# EAGLE design nixie12b_clock (EAGLE 6.5.0)
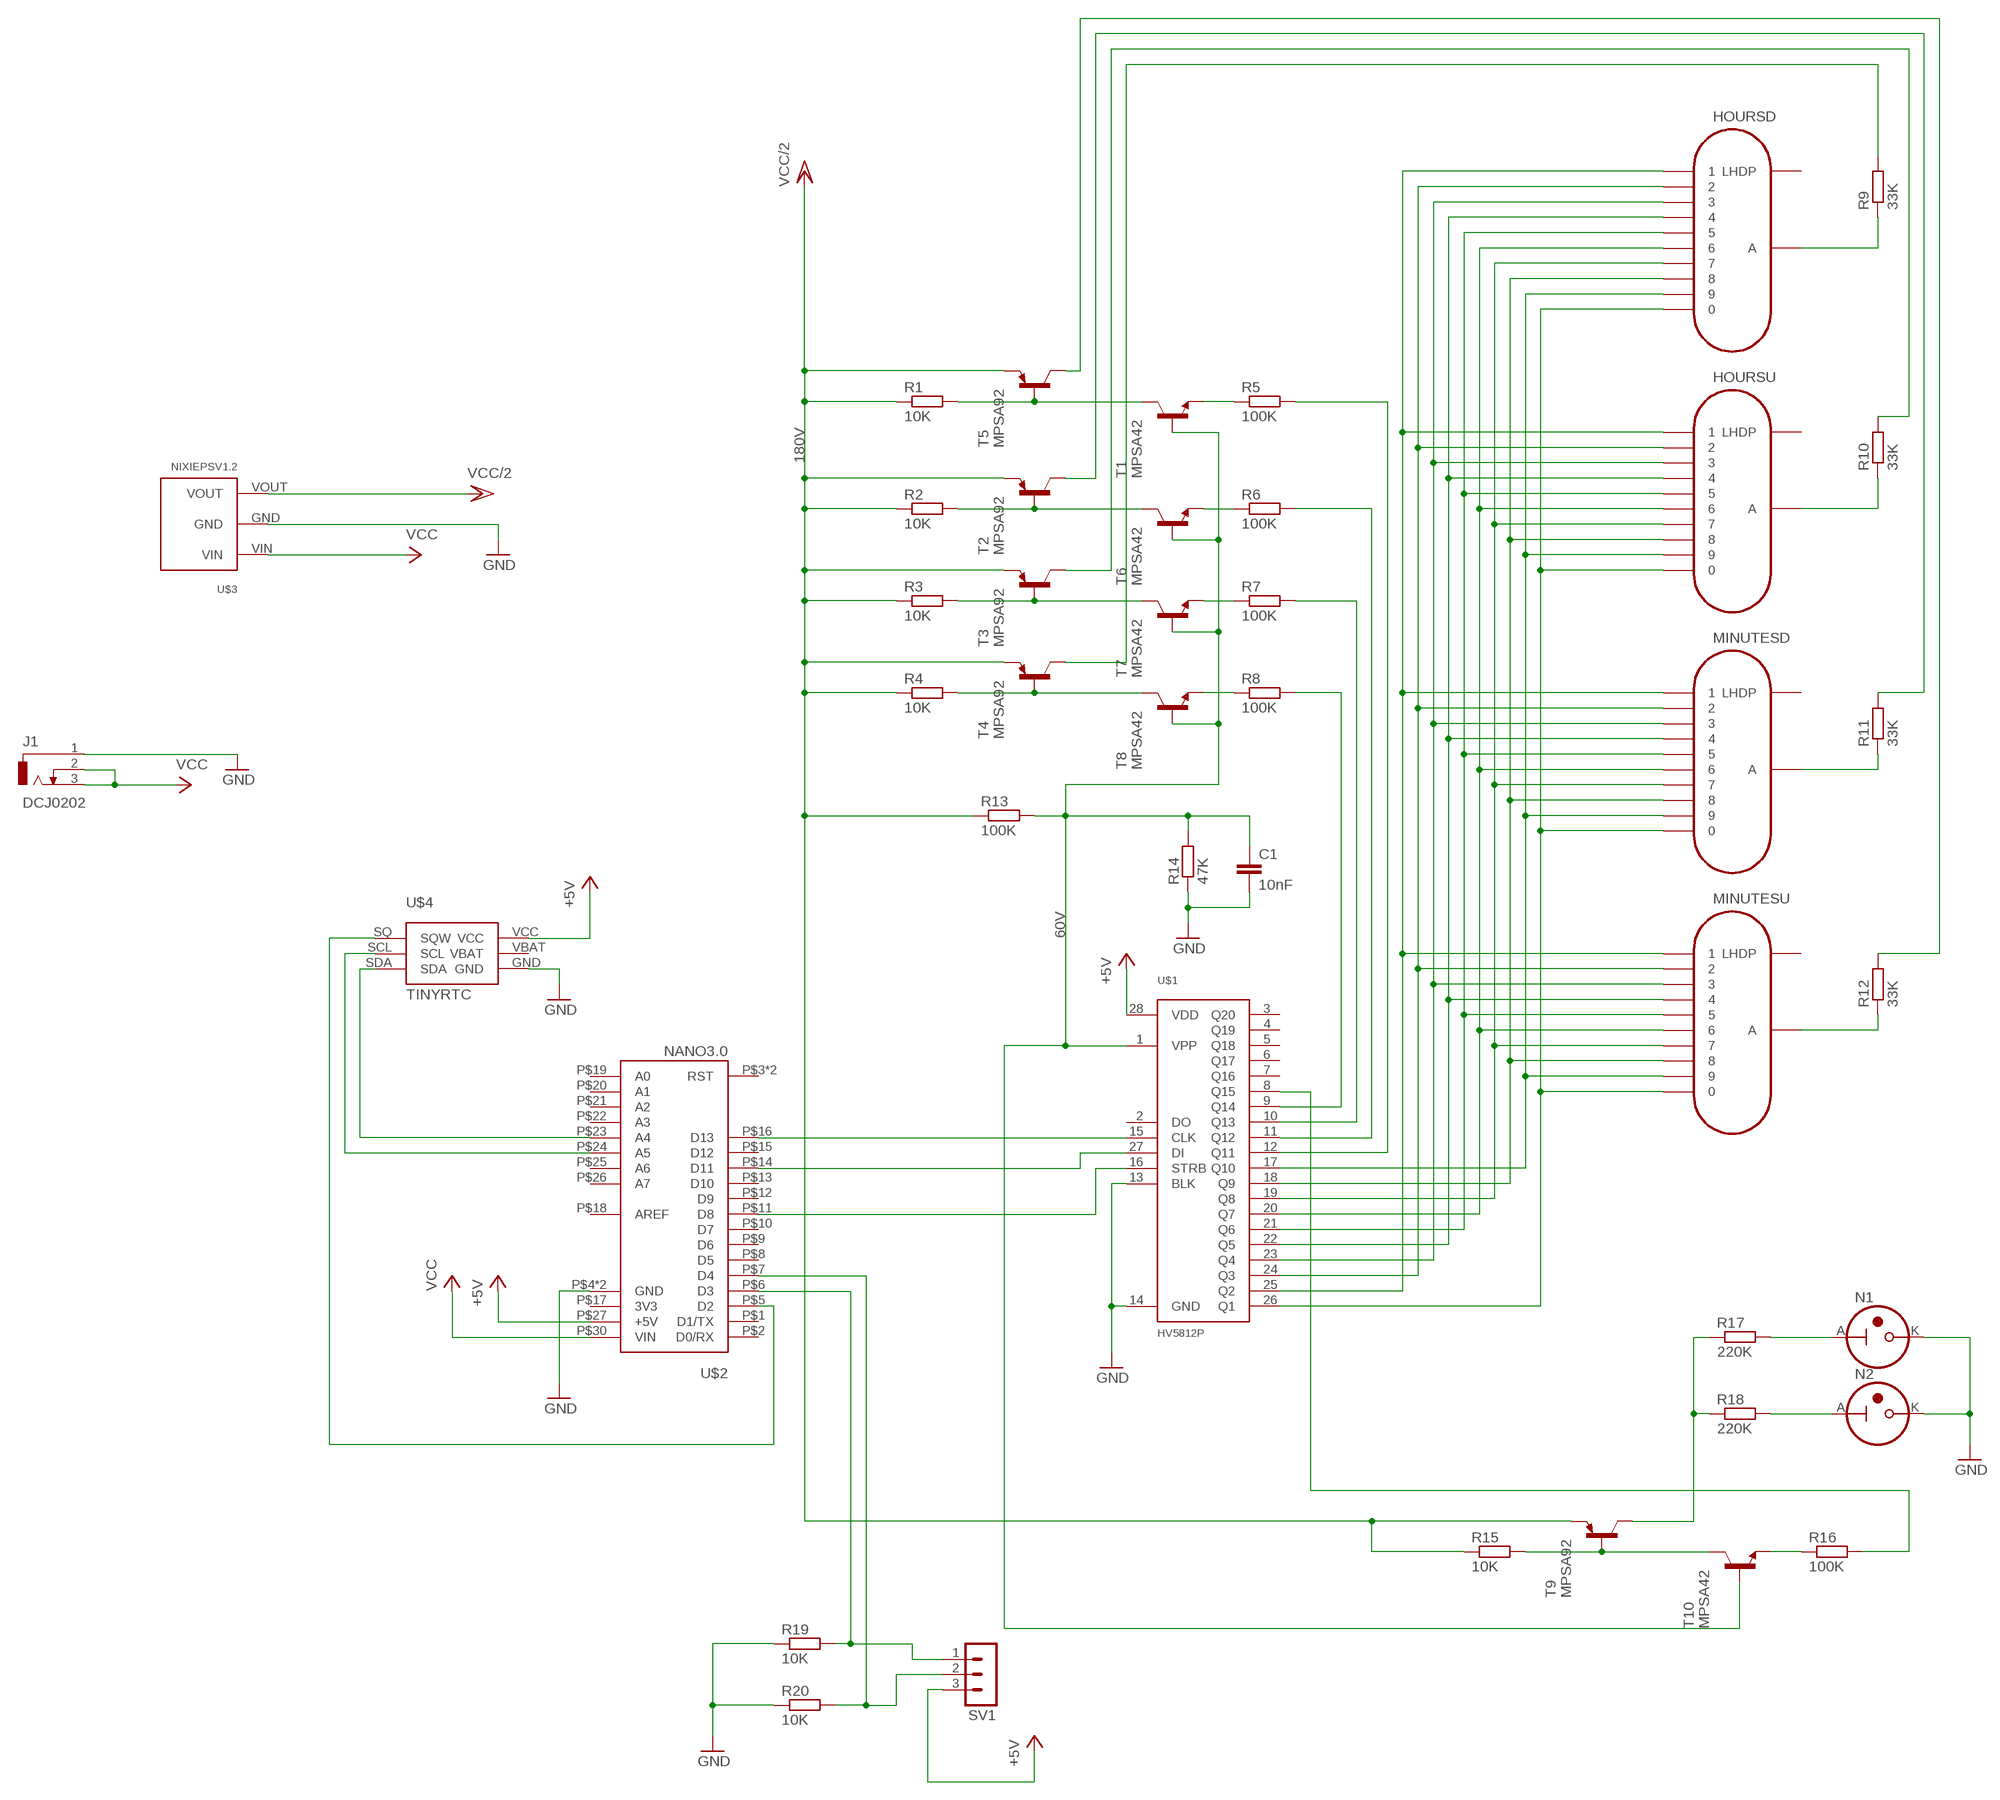
[diagram p0: schematic, sheet 1]

## Parts
C1  10nF  C5/2.5  [C5B2.5]
HOURSD  IN-12BP  [IN-12-2]
HOURSU  IN-12BP  [IN-12-2]
J1  DCJ0202  [DCJ0202]
MINUTESD  IN-12BP  [IN-12-2]
MINUTESU  IN-12BP  [IN-12-2]
N1  IN-3  [IN-3]
N2  IN-3  [IN-3]
R1  10K  R-EU_0207/10  [0207/10]
R2  10K  R-EU_0207/10  [0207/10]
R3  10K  R-EU_0207/10  [0207/10]
R4  10K  R-EU_0207/10  [0207/10]
R5  100K  R-EU_0207/10  [0207/10]
R6  100K  R-EU_0207/10  [0207/10]
R7  100K  R-EU_0207/10  [0207/10]
R8  100K  R-EU_0207/10  [0207/10]
R9  33K  R-EU_0207/10  [0207/10]
R10  33K  R-EU_0207/10  [0207/10]
R11  33K  R-EU_0207/10  [0207/10]
R12  33K  R-EU_0207/10  [0207/10]
R13  100K  R-EU_0207/10  [0207/10]
R14  47K  R-EU_0207/10  [0207/10]
R15  10K  R-EU_0207/10  [0207/10]
R16  100K  R-EU_0207/10  [0207/10]
R17  220K  R-EU_0207/10  [0207/10]
R18  220K  R-EU_0207/10  [0207/10]
R19  10K  R-EU_0207/10  [0207/10]
R20  10K  R-EU_0207/10  [0207/10]
SV1  MA03-1  [MA03-1]
T1  MPSA42  MPSA42-NPN-TO92-EBC  [TO92-EBC]
T2  MPSA92  MPSA92-PNP-TO92-EBC  [TO92-EBC]
T3  MPSA92  MPSA92-PNP-TO92-EBC  [TO92-EBC]
T4  MPSA92  MPSA92-PNP-TO92-EBC  [TO92-EBC]
T5  MPSA92  MPSA92-PNP-TO92-EBC  [TO92-EBC]
T6  MPSA42  MPSA42-NPN-TO92-EBC  [TO92-EBC]
T7  MPSA42  MPSA42-NPN-TO92-EBC  [TO92-EBC]
T8  MPSA42  MPSA42-NPN-TO92-EBC  [TO92-EBC]
T9  MPSA92  MPSA92-PNP-TO92-EBC  [TO92-EBC]
T10  MPSA42  MPSA42-NPN-TO92-EBC  [TO92-EBC]
U$1  HV5812P  [28-PDIP]
U$2  NANO3.0  [NANO3.0_HEADERS]
U$3  NIXIEPSV1.2  [NIXIEPSV1.2]
U$4  TINYRTC  [TINYRTC]

## Nets
+5V: SV1.3 U$1.28(VDD) U$2.P$27(+5V) U$4.VCC
GND: C1.2 J1.1 N1.K N2.K R14.1 R19.1 R20.1 U$1.13(BLK) U$1.14(GND) U$2.P$4(GND) U$2.P$29(GND) U$3.GND U$4.GND
N$1: HOURSD.1 HOURSU.1 MINUTESD.1 MINUTESU.1 U$1.25(Q2)
N$2: HOURSD.2 HOURSU.2 MINUTESD.2 MINUTESU.2 U$1.24(Q3)
N$3: HOURSD.3 HOURSU.3 MINUTESD.3 MINUTESU.3 U$1.23(Q4)
N$4: HOURSD.4 HOURSU.4 MINUTESD.4 MINUTESU.4 U$1.22(Q5)
N$5: HOURSD.5 HOURSU.5 MINUTESD.5 MINUTESU.5 U$1.21(Q6)
N$6: HOURSD.6 HOURSU.6 MINUTESD.6 MINUTESU.6 U$1.20(Q7)
N$7: HOURSD.7 HOURSU.7 MINUTESD.7 MINUTESU.7 U$1.19(Q8)
N$8: HOURSD.8 HOURSU.8 MINUTESD.8 MINUTESU.8 U$1.18(Q9)
N$9: HOURSD.9 HOURSU.9 MINUTESD.9 MINUTESU.9 U$1.17(Q10)
N$10: HOURSD.0 HOURSU.0 MINUTESD.0 MINUTESU.0 U$1.26(Q1)
N$11: R1.2 T1.C T5.B
N$12: R2.2 T2.B T6.C
N$13: R3.2 T3.B T7.C
N$14: R4.2 T4.B T8.C
N$15: R5.1 T1.E
N$16: R6.1 T6.E
N$17: R7.1 T7.E
N$18: R8.1 T8.E
N$19: C1.1 R13.2 R14.2 T1.B T6.B T7.B T8.B T10.B U$1.1(VPP)
N$20: R5.2 U$1.12(Q11)
N$21: R6.2 U$1.11(Q12)
N$22: R7.2 U$1.10(Q13)
N$23: R8.2 U$1.9(Q14)
N$24: R9.2 T4.C
N$25: HOURSD.A R9.1
N$26: R10.2 T3.C
N$27: HOURSU.A R10.1
N$28: R11.2 T2.C
N$29: MINUTESD.A R11.1
N$30: R12.2 T5.C
N$31: MINUTESU.A R12.1
N$32: R15.2 T9.B T10.C
N$33: U$1.16(STRB) U$2.P$11(D8)
N$34: U$1.27(DI) U$2.P$14(D11)
N$35: U$1.15(CLK) U$2.P$16(D13)
N$36: R19.2 SV1.1 U$2.P$6(D3)
N$37: R16.2 U$1.8(Q15)
N$38: R17.1 R18.1 T9.C
N$39: R16.1 T10.E
N$40: N1.A R17.2
N$41: N2.A R18.2
N$42: U$2.P$24(A5) U$4.SCL
N$43: U$2.P$23(A4) U$4.SDA
N$44: U$2.P$5(D2) U$4.SQ(SQW)
N$45: R20.2 SV1.2 U$2.P$7(D4)
VCC: J1.2 J1.3 U$2.P$30(VIN) U$3.VIN
VCC/2: R1.1 R2.1 R3.1 R4.1 R13.1 R15.1 T2.E T3.E T4.E T5.E T9.E U$3.VOUT
Unconnected: HOURSD.LHDP HOURSU.LHDP MINUTESD.LHDP MINUTESU.LHDP U$1.2(DO) U$1.3(Q20) U$1.4(Q19) U$1.5(Q18) U$1.6(Q17) U$1.7(Q16) U$2.P$1(D1/TX) U$2.P$2(D0/RX) U$2.P$3(RST) U$2.P$8(D5) U$2.P$9(D6) U$2.P$10(D7) U$2.P$12(D9) U$2.P$13(D10) U$2.P$15(D12) U$2.P$18(AREF) U$2.P$19(A0) U$2.P$20(A1) U$2.P$21(A2) U$2.P$22(A3) U$2.P$25(A6) U$2.P$26(A7) U$2.P$28(RST)

## Notes on the sheet
- 180V
- 60V

## Power pins joined to a net without a drawn wire
3V3: U$2.P$17(3V3)
VBAT: U$4.VBAT

## Library data of the parts
C1 = capacitor-wima:C: CAPACITOR naming: grid - package width
HOURSD HOURSU MINUTESD MINUTESU = russian-nixies:IN-12B: IN-12B: medium numeric topview nixie tube
J1 = con-jack:DCJ0202: DC POWER JACK Source: DCJ0202.pdf; OC_FARNELL: unknown; OC_NEWARK: unknown
N1 N2 = russian-nixies:IN-3: IN-3: nixie bulb
R1-R20 = resistor:R-EU_: RESISTOR, European symbol
SV1 = con-lstb:MA03-1: PIN HEADER; OC_FARNELL: unknown; OC_NEWARK: unknown
T1 T6-T8 T10 = transistor:*-NPN-: NPN Transistror BF959 corrected 2008.03.06
T2-T5 T9 = transistor:*-PNP-: PNP Transistror
U$1 = supertex2:HV5812: Supertex HV5812
U$2 = arduino:NANO3.0
U$3 = breakboard:NIXIEPSV1.2
U$4 = breakboard:TINYRTC

## Board
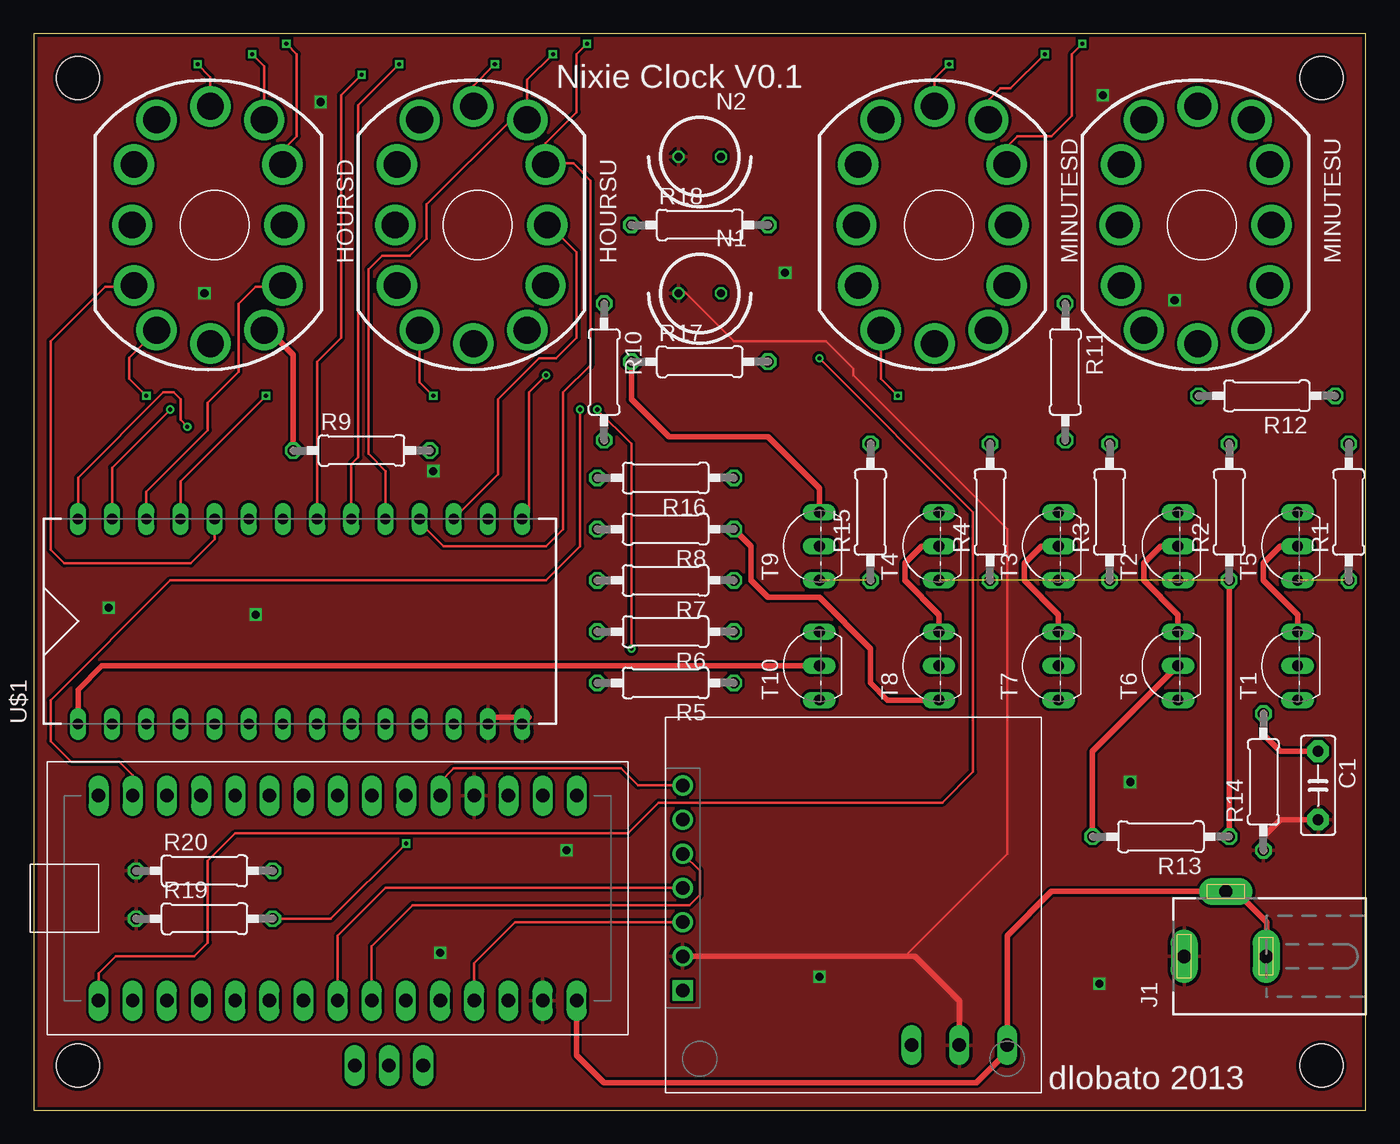
[diagram p1: board, top side]
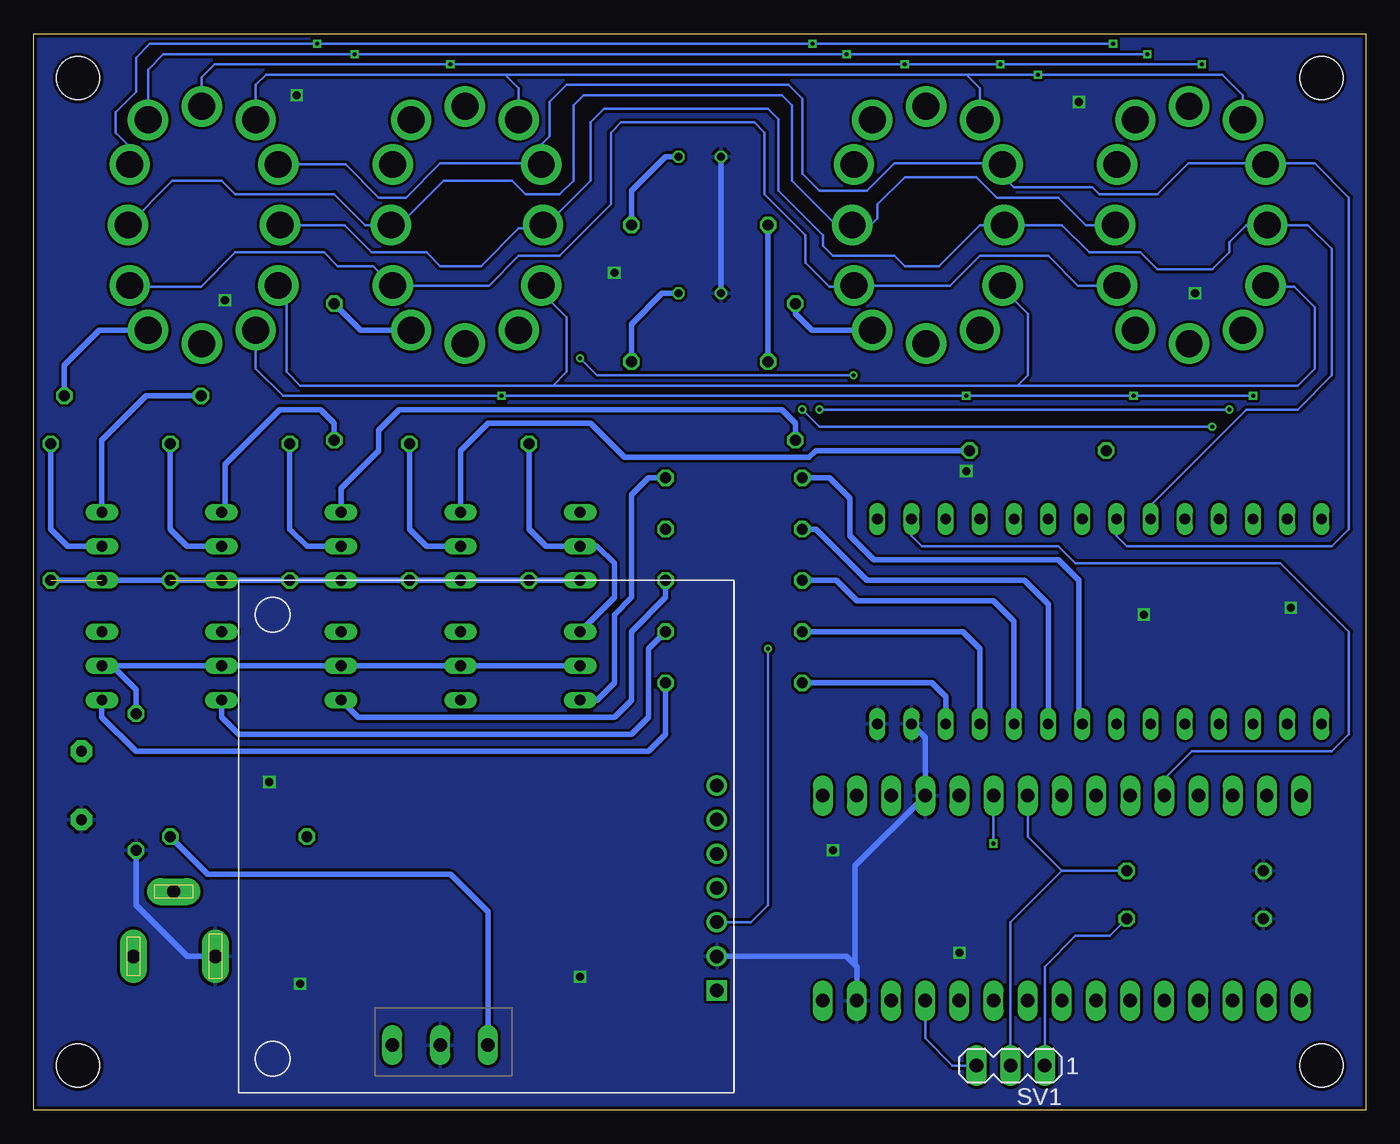
[diagram p2: board, bottom side, seen from below]

Size 99.06 x 80.01 mm. Coordinates in mm from the lower left corner, seen from the top.
Outline: 0,0 99.06,0 99.06,80.01 0,80.01 0,0
Copper layers (1*16): Top 0.035mm / dielectric 0.73mm / Bottom 0.035mm
Design rules "SeeedStudio_DRU_no_angle_20130527 *": minimum track width 8mil, minimum drill 12mil, track to track 8mil, track to pad 8mil, pad to pad 6mil, via to via 6mil, smd to smd 0mil, copper to edge 10mil, drill to drill 10mil, minimum pad ring 6mil, minimum via ring 6mil, stop-mask expansion 2mil, vias tented up to drill 25mil, thermal gap 10mil
Holes 3.2 mm at 3.3,76.71 95.76,76.71 95.76,3.3 3.3,3.3

### Footprints (pad centres in the part's own frame; a part is rotated, then mirrored left to right if it is on the bottom)
C5B2.5 = drill 0.813 pad 1.6 octagon: 1 -2.54,0; 2 2.54,0
IN-12-2 = drill 2 pad 2.54: 0 5.048,-4.5; 1 -4.317,-7.817; 2 -6,-4.5; 3 -6.127,0; 4 -6,4.5; 5 -4.317,7.817; 6 -0.318,8.818; 7 3.683,7.817; 8 5.048,4.5; 9 5.175,0; A 3.683,-7.817; LHDP -0.318,-8.818
DCJ0202 = drill 1 pad 2 long: 1 0,3.1; 2 4.8,0; 3 0,-3
IN-3 = drill 0.6 octagon: A -1.587,0; K 1.587,0
0207/10 = drill 0.813 octagon: 1 -5.08,0; 2 5.08,0
MA03-1 = drill 1.016 long: 1 -2.54,0; 2 0,0; 3 2.54,0
TO92-EBC = drill 0.813 long: B 0,-1.27; C 2.54,-1.27; E -2.54,-1.27
28-PDIP = drill 0.8 long: 1 -7.62,16.51; 2 -7.62,13.97; 3 -7.62,11.43; 4 -7.62,8.89; 5 -7.62,6.35; 6 -7.62,3.81; 7 -7.62,1.27; 8 -7.62,-1.27; 9 -7.62,-3.81; 10 -7.62,-6.35; 11 -7.62,-8.89; 12 -7.62,-11.43; 13 -7.62,-13.97; 14 -7.62,-16.51; 15 7.62,-16.51; 16 7.62,-13.97; 17 7.62,-11.43; 18 7.62,-8.89; 19 7.62,-6.35; 20 7.62,-3.81; 21 7.62,-1.27; 22 7.62,1.27; 23 7.62,3.81; 24 7.62,6.35; 25 7.62,8.89; 26 7.62,11.43; 27 7.62,13.97; 28 7.62,16.51
NANO3.0_HEADERS = drill 1 long: P$1 -7.62,17.78; P$2 -7.62,15.24; P$3 -7.62,12.7; P$4 -7.62,10.16; P$5 -7.62,7.62; P$6 -7.62,5.08; P$7 -7.62,2.54; P$8 -7.62,0; P$9 -7.62,-2.54; P$10 -7.62,-5.08; P$11 -7.62,-7.62; P$12 -7.62,-10.16; P$13 -7.62,-12.7; P$14 -7.62,-15.24; P$15 -7.62,-17.78; P$16 7.62,-17.78; P$17 7.62,-15.24; P$18 7.62,-12.7; P$19 7.62,-10.16; P$20 7.62,-7.62; P$21 7.62,-5.08; P$22 7.62,-2.54; P$23 7.62,0; P$24 7.62,2.54; P$25 7.62,5.08; P$26 7.62,7.62; P$27 7.62,10.16; P$28 7.62,12.7; P$29 7.62,15.24; P$30 7.62,17.78
NIXIEPSV1.2 = drill 1 long: GND -15.494,4.064; VIN -15.494,7.62; VOUT -15.494,0.508
TINYRTC = drill 1: DS 12.7,-6.35; GND 12.7,3.81; SCL 12.7,-3.81; SDA 12.7,-1.27; SQ 12.7,-8.89; VCC 12.7,1.27 | drill 1 square: VBAT 12.7,6.35

### Placement (x,y rotation side)
C1  95.5,24.13 270 top
HOURSD  13.46,65.79 0 top
HOURSU  33.02,65.79 0 top
J1  88.65,11.43 90 top
MINUTESD  67.31,65.79 0 top
MINUTESU  86.87,65.79 0 top
N1  49.53,60.71 180 top
N2  49.53,70.87 180 top
R1  97.79,44.45 90 top
R2  88.9,44.45 90 top
R3  80.01,44.45 90 top
R4  71.12,44.45 90 top
R5  46.99,31.75 180 top
R6  46.99,35.56 180 top
R7  46.99,39.37 180 top
R8  46.99,43.18 180 top
R9  24.38,49.02 0 top
R10  42.42,54.86 270 top
R11  76.71,54.86 270 top
R12  91.69,53.09 180 top
R13  83.82,20.32 180 top
R14  91.44,24.38 90 top
R15  62.23,44.45 90 top
R16  46.99,46.99 180 top
R17  49.53,55.63 0 top
R18  49.53,65.79 0 top
R19  12.7,14.22 0 top
R20  12.7,17.78 0 top
SV1  26.42,3.3 180 bottom
T1  92.71,33.02 90 top
T2  83.82,41.91 90 top
T3  74.93,41.91 90 top
T4  66.04,41.91 90 top
T5  92.71,41.91 90 top
T6  83.82,33.02 90 top
T7  74.93,33.02 90 top
T8  66.04,33.02 90 top
T9  57.15,41.91 90 top
T10  57.15,33.02 90 top
U$1  19.81,36.32 90 top
U$2  22.61,15.75 270 top
U$3  64.77,20.32 90 bottom
U$4  60.96,15.24 180 top

### Tracks (layer width: path | path; a pad name or v marks a point on that pad's centre or on a via)
+5V  (via drill 0.3)
  Top 0.203: v41.91,52.07 44.45,49.53 v44.45,34.29 | v11.43,50.8 10.92,51.31 10.92,52.83 10.41,53.34 9.65,53.34 3.3,46.99 U$1.28 | U$4.VCC 35.81,13.97 32.77,10.92 U$2.P$27
  Bottom 0.203: v11.43,50.8 40.64,50.8 v41.91,52.07 | U$2.P$27 32.77,5.33 30.73,3.3 SV1.3 | v44.45,34.29 44.45,15.24 45.72,13.97 U$4.VCC
GND  (via drill 0.6)
  Top 0.203: 64.77,11.43 72.39,19.05 72.39,43.18 60.96,54.61 60.96,55.12 58.93,57.15 52.07,57.15 48.26,60.96 N1.K
  Top 0.406: U$3.GND 68.83,8.13 65.53,11.43 64.77,11.43 U$4.GND | U$1.14 36.83,29.21 34.29,29.21 U$1.13 | R14.1 91.44,20.32 92.71,21.59 C1.2
  Bottom 0.406: N2.K N1.K | U$1.13 32.77,27.69 U$2.P$4 37.97,18.16 37.97,10.79 | U$4.GND 38.61,11.43 37.97,10.79 | 37.97,10.79 37.85,10.67 U$2.P$29 | R14.1 91.44,15.24 87.63,11.43 J1.1
  other vias: 5.59,37.34 39.62,19.3 30.23,11.68 16.51,36.83 29.72,47.5 12.7,60.71 21.34,74.93 55.88,62.23 84.84,60.2 79.5,75.44 58.42,9.91 79.25,9.4 81.53,24.38
  pour Top (isolate 0.203): 99.06,80.01 99.06,0 0,0 0,80.01
  pour Bottom (isolate 0.203): 0.25,80.01 99.06,80.01 99.06,-0.25 0,-0.25 0,80.01
N$1  (via drill 0.3)
  Top 0.203: v8.38,53.09 7.11,54.36 7.11,55.94 HOURSD.1 | HOURSU.1 28.7,54.1 v29.72,53.09 | MINUTESD.1 62.99,54.35 v64.26,53.09 | U$1.25 10.92,46.74 v17.27,53.09
  Bottom 0.203: v8.38,53.09 v17.27,53.09 v29.72,53.09 v64.26,53.09 80.52,53.09 82.55,55.12 MINUTESU.1 | MINUTESU.1
N$2
  Top 0.203: U$1.24 13.46,42.42 11.68,40.64 2.29,40.64 1.27,41.66 1.27,57.15 5.33,61.21 7.39,61.21 HOURSD.2
  Bottom 0.203: 60.45,53.85 79.25,53.85 80.26,54.86 80.26,60.68 MINUTESU.2 | 60.45,53.85 25.91,53.85 | 25.91,53.85 5.08,53.85 3.81,55.12 3.81,59.69 5.33,61.21 7.39,61.21 HOURSD.2 | MINUTESD.2 61.31,60.8 59.44,58.93 59.44,54.86 60.45,53.85 | HOURSU.2 27.02,61.06 25.15,59.18 25.15,54.61 25.91,53.85
N$3
  Bottom 0.203: 6.86,65.79 HOURSD.3 | HOURSD.3 4.32,65.79 2.54,64.01 2.54,54.61 5.08,52.07 8.89,52.07 16,44.96 U$1.23 | HOURSD.3 8.89,65.79 10.16,64.52 10.16,63.75 11.43,62.48 15.49,62.48 16.76,63.75 20.57,63.75 22.61,65.79 HOURSU.3 28.7,65.79 31.75,62.74 34.29,62.74 35.05,63.5 39.62,63.5 40.39,64.26 40.39,65.02 43.69,68.33 43.69,73.66 44.45,74.42 56.64,74.42 57.66,73.41 57.66,69.09 60.96,65.79 MINUTESD.3 61.44,65.53 62.99,65.53 65.79,62.74 68.83,62.74 69.85,63.75 73.91,63.75 75.95,65.79 MINUTESU.3
N$4
  Bottom 0.203: U$1.22 18.54,42.67 17.78,41.91 2.54,41.91 1.27,43.18 1.27,67.82 3.81,70.36 7.39,70.36 HOURSD.4 7.53,70.36 13.21,70.36 15.49,68.07 19.81,68.07 20.32,68.58 26.16,68.58 27.02,69.44 HOURSU.4 27.09,70.36 35.05,70.36 37.08,68.33 40.64,68.33 41.91,69.6 41.91,75.18 42.93,76.2 59.44,76.2 60.71,74.93 60.71,72.39 61.31,71.79 MINUTESD.4 61.38,70.36 68.83,70.36 71.37,67.82 73.41,67.82 75.87,70.29 MINUTESU.4
N$5  (via drill 0.3)
  Top 0.203: U$1.21 21.08,55.63 22.86,57.4 22.86,75.44 v24.38,76.96
  Bottom 0.203: MINUTESU.5 82.55,76.2 81.79,76.96 64.01,76.96 | 64.01,76.96 29.72,76.96 | 29.72,76.96 v24.38,76.96 10.67,76.96 9.14,75.44 HOURSD.5 | MINUTESD.5 62.99,75.95 64.01,76.96 | HOURSU.5 28.7,75.95 29.72,76.96
N$6  (via drill 0.3)
  Top 0.203: MINUTESD.6 66.99,76.64 v68.07,77.72 | HOURSU.6 32.7,76.14 v34.29,77.72 | U$1.20 23.62,48.01 24.13,48.51 24.13,74.68 v27.18,77.72 | HOURSD.6 13.14,76.77 v12.19,77.72
  Bottom 0.203: v12.19,77.72 v27.18,77.72 v34.29,77.72 v68.07,77.72 85.6,77.72 86.55,76.77 MINUTESU.6
N$7  (via drill 0.3)
  Top 0.203: MINUTESD.7 70.99,75.06 71.88,75.95 72.64,75.95 v75.18,78.49 | v38.61,78.49 36.7,76.58 HOURSU.7 35.56,73.66 29.21,67.31 29.21,64.77 27.94,63.5 25.91,63.5 24.89,62.48 24.89,48.77 26.16,47.5 U$1.19 | HOURSD.7 17.14,77.6 v16.26,78.49
  Bottom 0.203: v16.26,78.49 v38.61,78.49 v75.18,78.49 89.41,78.49 90.55,77.34 MINUTESU.7
N$8  (via drill 0.3)
  Top 0.203: MINUTESD.8 72.36,71.6 73.15,72.39 75.69,72.39 77.22,73.91 77.22,78.49 v77.98,79.25 | v41.15,79.25 40.39,78.49 40.39,74.17 38.07,71.85 HOURSU.8 38.14,70.36 40.13,70.36 41.4,69.09 41.4,55.37 39.37,53.34 39.37,43.18 38.1,41.91 30.48,41.91 28.7,43.69 U$1.18 | HOURSD.8 18.51,71.34 19.56,72.39 19.56,78.49 v18.8,79.25
  Bottom 0.203: v18.8,79.25 v41.15,79.25 v77.98,79.25 90.42,79.25 91.44,78.23 91.44,75.69 92.96,74.17 92.96,72.64 91.92,71.6 MINUTESU.8
N$9
  Top 0.203: U$1.17 34.54,47.24 34.54,52.83 37.59,55.88 38.86,55.88 40.39,57.4 40.39,63.75 38.35,65.79 HOURSU.9
  Bottom 0.203: HOURSD.9 20.83,65.79 22.86,67.82 27.43,67.82 28.96,69.34 34.29,69.34 36.32,67.31 36.32,66.29 36.83,65.79 HOURSU.9 39.37,65.79 42.67,69.09 42.67,74.68 43.43,75.44 58.17,75.44 58.93,74.68 58.93,69.09 59.94,68.07 62.48,68.07 63.5,69.09 68.58,69.09 71.88,65.79 MINUTESD.9 74.42,65.79 76.71,68.07 84.07,68.07 85.09,69.09 88.74,69.09 MINUTESU.9
N$10
  Top 0.203: U$1.26 8.38,45.97 12.95,50.55 12.95,52.58 15.24,54.86 15.24,59.94 16.51,61.21 18.44,61.21 HOURSD.0
  Bottom 0.203: HOURSD.0 21.41,61.29 23.62,63.5 28.7,63.5 30.92,61.29 HOURSU.0 38.14,61.21 39.88,61.21 41.66,62.99 41.66,65.02 44.7,68.07 44.7,72.64 45.47,73.41 55.37,73.41 56.13,72.64 56.13,67.31 59.94,63.5 62.99,63.5 65.21,61.29 MINUTESD.0 73.81,62.74 76.45,62.74 77.47,63.75 84.07,63.75 86.61,61.21 91.84,61.21 MINUTESU.0
N$11
  Top 0.406: T1.C 93.98,36.83 91.44,39.37 91.44,40.64 92.71,41.91 T5.B
  Bottom 0.406: T5.B 96.52,41.91 97.79,43.18 R1.2
N$12
  Top 0.406: T6.C 85.09,36.83 82.55,39.37 82.55,40.64 83.82,41.91 T2.B
  Bottom 0.406: T2.B 87.63,41.91 88.9,43.18 R2.2
N$13
  Top 0.406: T7.C 76.2,36.83 73.66,39.37 73.66,40.64 74.93,41.91 T3.B
  Bottom 0.406: T3.B 78.74,41.91 80.01,43.18 R3.2
N$14
  Top 0.406: T8.C 67.31,36.83 64.77,39.37 64.77,40.64 66.04,41.91 T4.B
  Bottom 0.406: T4.B 69.85,41.91 71.12,43.18 R4.2
N$15
  Bottom 0.406: T1.E 93.98,29.21 91.44,26.67 53.34,26.67 52.07,27.94 R5.1
N$16
  Bottom 0.406: T6.E 85.09,29.21 83.82,27.94 54.61,27.94 53.34,29.21 53.34,34.29 R6.1
N$17
  Bottom 0.406: T7.E 74.93,29.21 55.88,29.21 54.61,30.48 54.61,35.56 52.07,38.1 R7.1
N$18
  Top 0.406: T8.E 63.5,30.48 62.23,31.75 62.23,34.29 58.42,38.1 54.61,38.1 53.34,39.37 53.34,41.91 R8.1
N$19
  Top 0.406: U$1.1 3.3,31.24 5.08,33.02 T10.B | R13.2 78.74,26.67 T6.B | R14.2 91.44,27.94 92.71,26.67 C1.1
  Bottom 0.406: 93.22,33.02 T6.B T7.B T8.B T10.B | 93.22,33.02 T1.B | R14.2 91.44,31.24 93.22,33.02
N$20
  Bottom 0.406: R5.2 32.26,31.75 31.24,30.73 U$1.12
N$21
  Bottom 0.406: R6.2 29.97,35.56 28.7,34.29 U$1.11
N$22
  Bottom 0.406: R7.2 39.37,39.37 37.85,37.85 27.69,37.85 26.16,36.32 U$1.10
N$23
  Bottom 0.406: R8.2 40.89,43.18 37.08,39.37 25.4,39.37 23.62,37.59 U$1.9
N$24
  Bottom 0.406: T4.C 67.31,49.02 65.28,51.05 57.66,51.05 55.12,48.51 41.4,48.51 40.89,49.02 R9.2
N$25
  Top 0.406: HOURSD.A 17.47,57.97 19.3,56.13 R9.1
N$26
  Bottom 0.406: R10.2 42.42,51.05 43.43,52.07 71.88,52.07 73.41,50.55 73.41,49.02 76.2,46.23 T3.C
N$27
  Bottom 0.406: HOURSU.A 41.2,57.97 42.42,59.18 R10.1
N$28
  Bottom 0.406: R11.2 76.71,51.05 77.72,52.07 80.77,52.07 84.84,48.01 84.84,44.7 T2.C
N$29
  Bottom 0.406: MINUTESD.A 74.73,57.97 R11.1
N$30
  Bottom 0.406: R12.2 90.68,53.09 93.98,49.78 T5.C
N$31
  Bottom 0.406: MINUTESU.A 94.18,57.97 96.77,55.37 R12.1
N$32
  Bottom 0.406: R15.2 62.23,43.18 60.96,41.91 T9.B 57.15,41.91 55.88,40.64 55.88,38.1 T10.C
N$33
  Bottom 0.203: U$2.P$11 14.99,24.64 12.95,26.67 2.54,26.67 1.27,27.94 1.27,35.56 6.35,40.64 21.59,40.64 22.86,41.91 33.02,41.91 33.78,42.67 U$1.16
N$34  (via drill 0.3)
  Top 0.203: v10.16,52.07 5.84,47.75 U$1.27 | v40.64,52.07 40.64,41.91 38.1,39.37 10.16,39.37 1.27,30.48 1.27,27.43 2.79,25.91 6.35,25.91 7.37,24.89 U$2.P$14
  Bottom 0.203: v10.16,52.07 v40.64,52.07
N$35  (via drill 0.3)
  Top 0.203: v58.42,55.88 69.85,44.45 69.85,25.15 67.56,22.86 46.48,22.86 44.2,20.57 14.99,20.57 12.95,18.54 12.95,12.45 11.94,11.43 6.1,11.43 4.83,10.16 U$2.P$16 | v38.1,54.61 36.83,53.34 36.83,44.45 U$1.15
  Bottom 0.203: v58.42,55.88 57.15,54.61 v38.1,54.61
N$36  (via drill 0.3)
  Top 0.203: R19.2 22.1,14.22 v27.69,19.81
  Bottom 0.203: SV1.1 23.88,10.67 21.59,12.95 19.05,12.95 R19.2 18.29,14.22 | v27.69,19.81 U$2.P$6
N$37
  Bottom 0.406: R16.2 39.88,46.99 38.35,45.47 38.35,42.67 36.58,40.89 22.86,40.89 21.34,39.37 21.34,28.96 U$1.8
N$38
  Top 0.406: R17.1 44.45,52.83 47.24,50.04 54.61,50.04 58.42,46.23 T9.C
  Bottom 0.406: R18.1 R17.1
N$39
  Bottom 0.406: T10.E 57.15,30.48 55.88,31.75 55.88,36.83 54.61,38.1 54.61,45.72 53.34,46.99 R16.1
N$40
  Bottom 0.406: N1.A 52.32,60.71 54.61,58.42 R17.2
N$41
  Bottom 0.406: N2.A 52.07,70.87 54.61,68.33 R18.2
N$42
  Top 0.203: U$4.SCL 49.53,17.78 49.53,16 48.77,15.24 28.19,15.24 25.15,12.19 U$2.P$24
N$43
  Top 0.203: U$4.SDA 26.16,16.51 22.61,12.95 U$2.P$23
N$44
  Top 0.203: U$4.SQ 44.96,24.13 43.69,25.4 31.24,25.4 30.23,24.38 U$2.P$5
N$45
  Bottom 0.203: R20.2 22.61,17.78 | 22.61,17.78 25.15,20.32 U$2.P$7 | SV1.2 26.42,13.97 22.61,17.78
VCC
  Top 0.406: U$2.P$30 40.39,4.06 42.42,2.03 70.1,2.03 72.39,4.32 U$3.VIN 72.39,12.95 75.69,16.26 88.62,16.26 J1.2 89.43,16.23 91.69,13.97 91.69,11.48 J1.3
VCC/2  (7 unrouted)
  Top 0.406: R13.1 R2.1
  Bottom 0.406: R1.1 T4.E T9.E | U$3.VOUT 65.28,14.73 68.07,17.53 86.11,17.53 R13.1

### Text on the board
tNames: Nixie Clock V0.1 | dlobato 2013